# Altium project filter_bank.PrjPcb
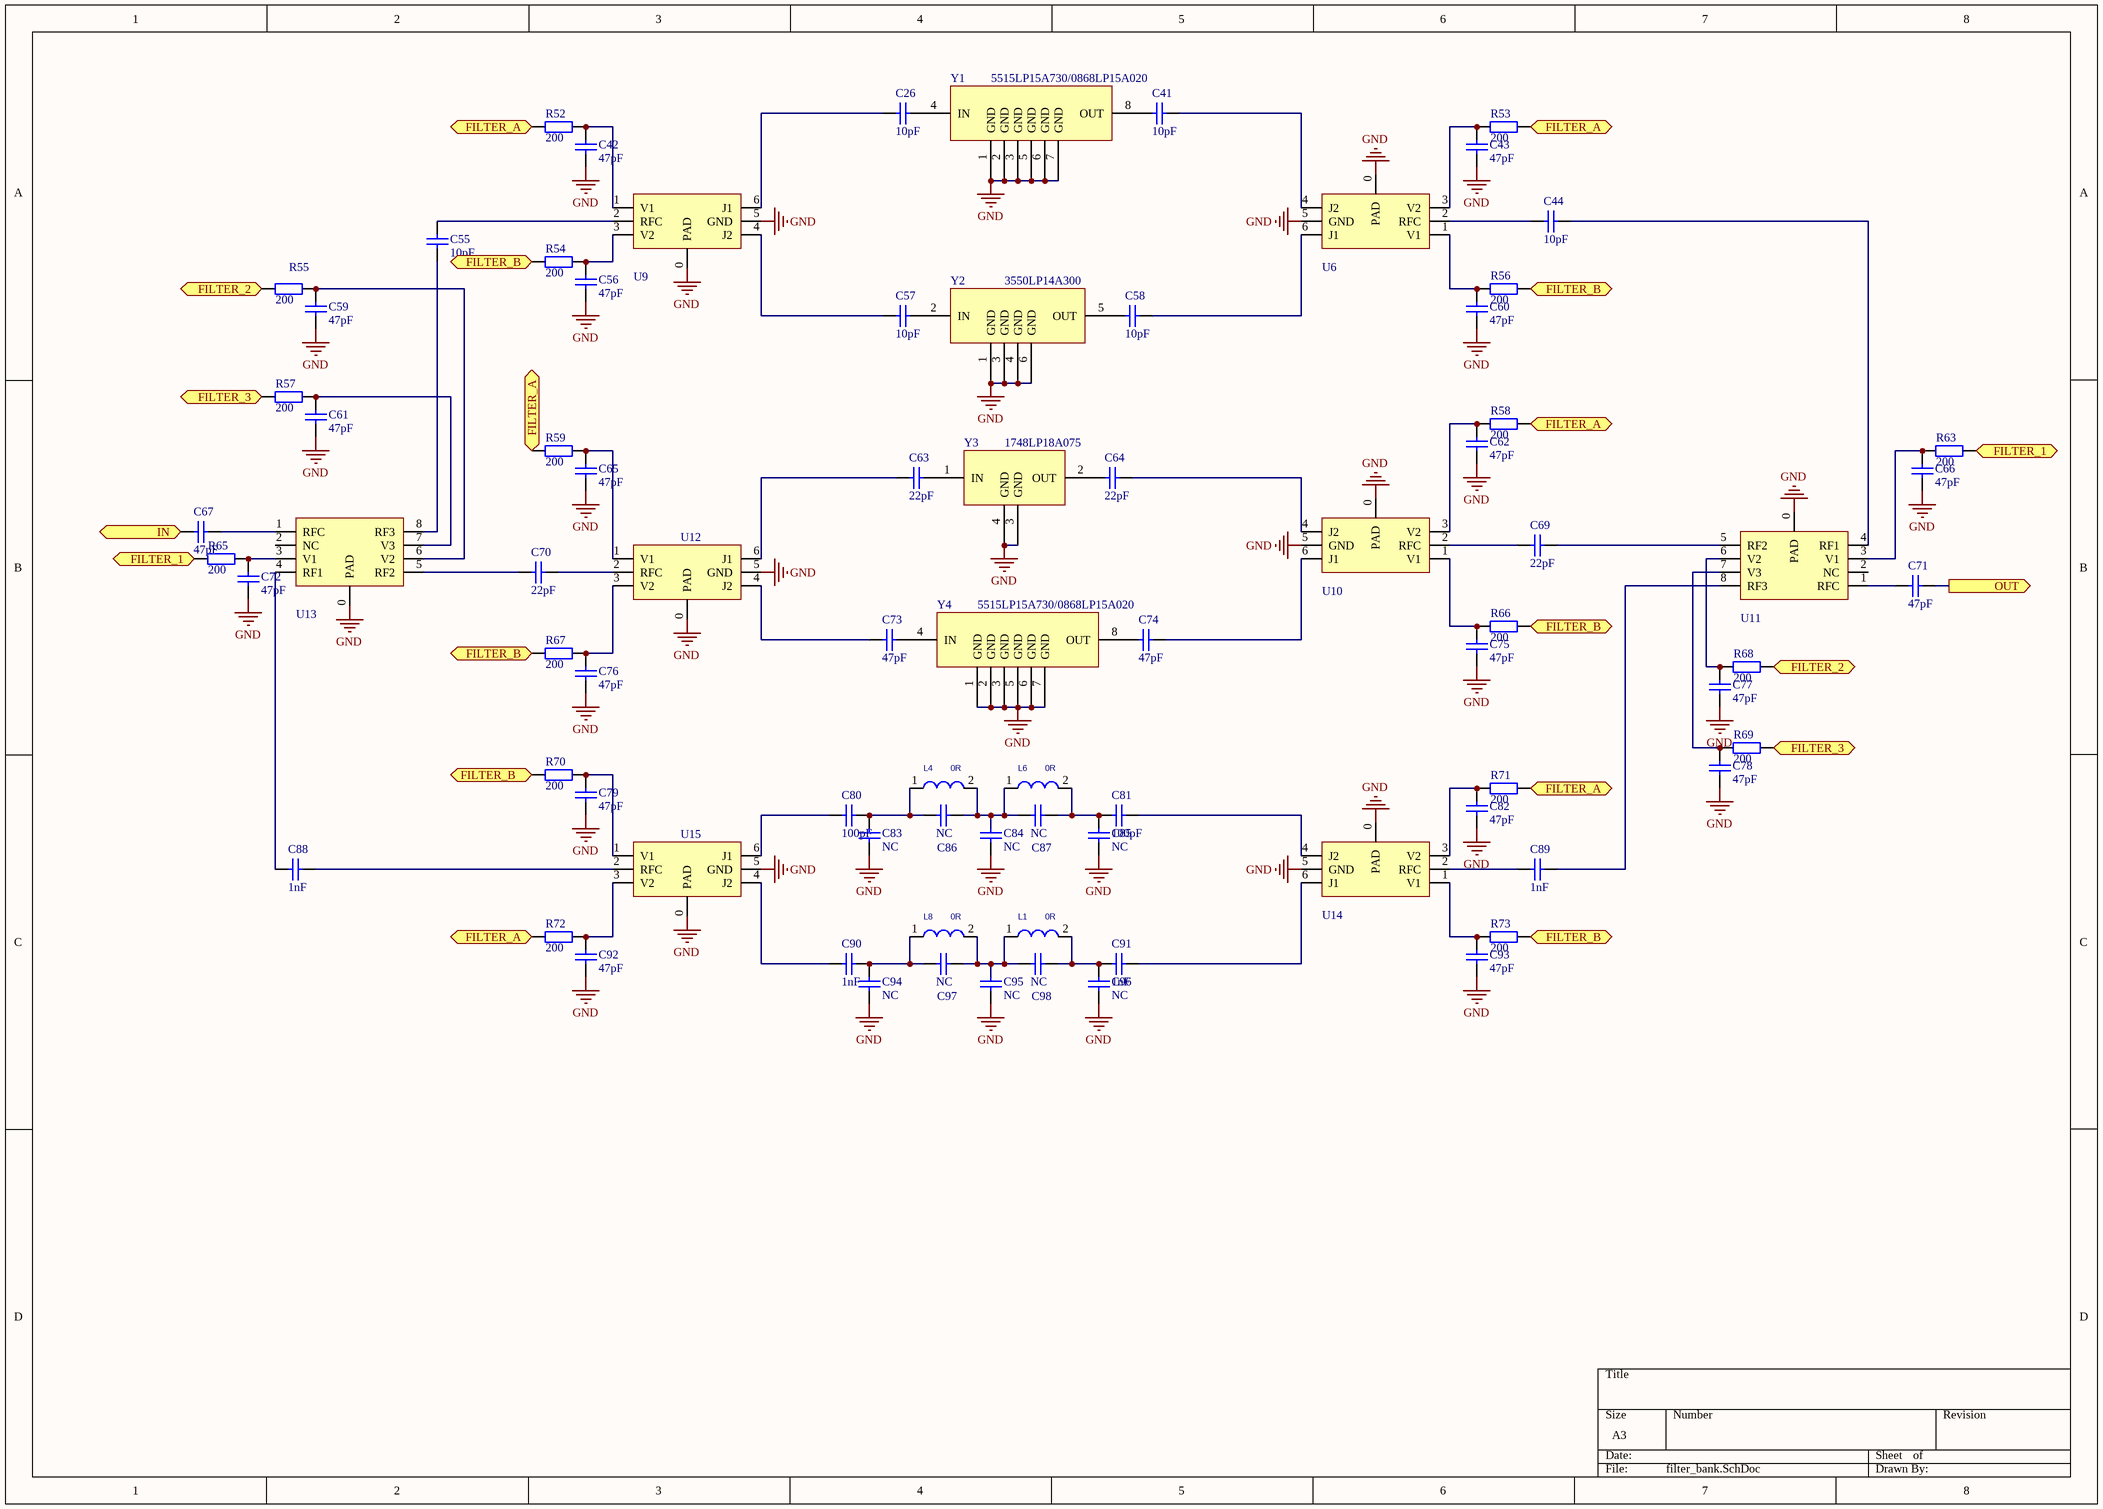
[diagram p0: filter_bank.SchDoc]
2 sheets, 91 parts. Net scope: flat (ports and power ports of the same name join across sheets).
Board file: filter_bank.PcbDoc
Sheets:
  filter_bank.SchDoc
  power.SchDoc

## Sheet filter_bank.SchDoc
size A3

### Parts
C26  10pF  [0402]
C41  10pF  [0402]
C42  47pF  [0402]
C43  47pF  [0402]
C44  10pF  [0402]
C55  10pF  [0402]
C56  47pF  [0402]
C57  10pF  [0402]
C58  10pF  [0402]
C59  47pF  [0402]
C60  47pF  [0402]
C61  47pF  [0402]
C62  47pF  [0402]
C63  22pF  [0402]
C64  22pF  [0402]
C65  47pF  [0402]
C66  47pF  [0402]
C67  47pF  [0402]
C69  22pF  [0402]
C70  22pF  [0402]
C71  47pF  [0402]
C72  47pF  [0402]
C73  47pF  [0402]
C74  47pF  [0402]
C75  47pF  [0402]
C76  47pF  [0402]
C77  47pF  [0402]
C78  47pF  [0402]
C79  47pF  [0402]
C80  100pF  [0402]
C81  100pF  [0402]
C82  47pF  [0402]
C83  NC  [0402]
C84  NC  [0402]
C85  NC  [0402]
C86  NC  [0402]
C87  NC  [0402]
C88  1nF  [0402]
C89  1nF  [0402]
C90  1nF  [0402]
C91  1nF  [0402]
C92  47pF  [0402]
C93  47pF  [0402]
C94  NC  [0402]
C95  NC  [0402]
C96  NC  [0402]
C97  NC  [0402]
C98  NC  [0402]
L1  0R  [0402]
L4  0R  [0402]
L6  0R  [0402]
L8  0R  [0402]
R52  200  [0402]
R53  200  [0402]
R54  200  [0402]
R55  200  [0402]
R56  200  [0402]
R57  200  [0402]
R58  200  [0402]
R59  200  [0402]
R63  200  [0402]
R65  200  [0402]
R66  200  [0402]
R67  200  [0402]
R68  200  [0402]
R69  200  [0402]
R70  200  [0402]
R71  200  [0402]
R72  200  [0402]
R73  200  [0402]
U6  SKY13320  [SKY65404-31]  (value not drawn)
U9  SKY13320  [SKY65404-31]  (value not drawn)
U10  SKY13320  [SKY65404-31]  (value not drawn)
U11  SKY13417  [SKY13317]  (value not drawn)
U12  SKY13320  [SKY65404-31]  (value not drawn)
U13  SKY13417  [SKY13317]  (value not drawn)
U14  SKY13320  [SKY65404-31]  (value not drawn)
U15  SKY13320  [SKY65404-31]  (value not drawn)
Y1  5515LP15A730/0868LP15A020  [5515LP15A730/0868LP15A020]
Y2  3550LP14A300  [3550LP14A300]
Y3  1748LP18A075  [1748LP18A075]
Y4  5515LP15A730/0868LP15A020  [5515LP15A730/0868LP15A020]

### Ports
FILTER_1, FILTER_2, FILTER_3, FILTER_A, FILTER_B, IN (in), OUT (out)

### Nets
GND: C42.1 C43.1 C56.1 C59.1 C60.1 C61.1 C62.1 C65.1 C66.1 C72.1 C75.1 C76.1 C77.1 C78.1 C79.1 C82.1 C83.1 C84.1 C85.1 C92.1 C93.1 C94.1 C95.1 C96.1 U6.0(PAD) U6.5(GND) U9.0(PAD) U9.5(GND) U10.0(PAD) U10.5(GND) U11.0(PAD) U12.0(PAD) U12.5(GND) U13.0(PAD) U14.0(PAD) U14.5(GND) U15.0(PAD) U15.5(GND) Y1.1(GND) Y1.2(GND) Y1.3(GND) Y1.5(GND) Y1.6(GND) Y1.7(GND) Y2.1(GND) Y2.3(GND) Y2.4(GND) Y2.6(GND) Y3.3(GND) Y3.4(GND) Y4.1(GND) Y4.2(GND) Y4.3(GND) Y4.5(GND) Y4.6(GND) Y4.7(GND)
NetAnt1_1: C67.2 ; port IN
NetAnt2_1: C71.1 ; port OUT
NetC26_1: C26.1 Y1.4(IN)
NetC26_2: C26.2 U9.6(J1)
NetC41_1: C41.1 U6.4(J2)
NetC41_2: C41.2 Y1.8(OUT)
NetC42_2: C42.2 R52.2 U9.1(V1)
NetC43_2: C43.2 R53.1 U6.3(V2)
NetC44_1: C44.1 U11.4(RF1)
NetC44_2: C44.2 U6.2(RFC)
NetC55_1: C55.1 U9.2(RFC)
NetC55_2: C55.2 U13.8(RF3)
NetC56_2: C56.2 R54.2 U9.3(V2)
NetC57_1: C57.1 Y2.2(IN)
NetC57_2: C57.2 U9.4(J2)
NetC58_1: C58.1 U6.6(J1)
NetC58_2: C58.2 Y2.5(OUT)
NetC59_2: C59.2 R55.1 U13.6(V2)
NetC60_2: C60.2 R56.1 U6.1(V1)
NetC61_2: C61.2 R57.2 U13.7(V3)
NetC62_2: C62.2 R58.1 U10.3(V2)
NetC63_1: C63.1 Y3.1(IN)
NetC63_2: C63.2 U12.6(J1)
NetC64_1: C64.1 Y3.2(OUT)
NetC64_2: C64.2 U10.4(J2)
NetC65_2: C65.2 R59.1 U12.1(V1)
NetC66_2: C66.2 R63.1 U11.3(V1)
NetC67_1: C67.1 U13.1(RFC)
NetC69_1: C69.1 U11.5(RF2)
NetC69_2: C69.2 U10.2(RFC)
NetC70_1: C70.1 U12.2(RFC)
NetC70_2: C70.2 U13.5(RF2)
NetC71_2: C71.2 U11.1(RFC)
NetC72_2: C72.2 R65.2 U13.3(V1)
NetC73_1: C73.1 Y4.4(IN)
NetC73_2: C73.2 U12.4(J2)
NetC74_1: C74.1 U10.6(J1)
NetC74_2: C74.2 Y4.8(OUT)
NetC75_2: C75.2 R66.1 U10.1(V1)
NetC76_2: C76.2 R67.2 U12.3(V2)
NetC77_2: C77.2 R68.1 U11.6(V2)
NetC78_2: C78.2 R69.1 U11.7(V3)
NetC79_2: C79.2 R70.2 U15.1(V1)
NetC80_1: C80.1 C83.2 C86.2 L4.1
NetC80_2: C80.2 U15.6(J1)
NetC81_1: C81.1 U14.4(J2)
NetC81_2: C81.2 C85.2 C87.1 L6.2
NetC82_2: C82.2 R71.1 U14.3(V2)
NetC84_2: C84.2 C86.1 C87.2 L4.2 L6.1
NetC88_1: C88.1 U15.2(RFC)
NetC88_2: C88.2 U13.4(RF1)
NetC89_1: C89.1 U11.8(RF3)
NetC89_2: C89.2 U14.2(RFC)
NetC90_1: C90.1 C94.2 C97.2 L8.1
NetC90_2: C90.2 U15.4(J2)
NetC91_1: C91.1 U14.6(J1)
NetC91_2: C91.2 C96.2 C98.1 L1.2
NetC92_2: C92.2 R72.2 U15.3(V2)
NetC93_2: C93.2 R73.1 U14.1(V1)
NetC95_2: C95.2 C97.1 C98.2 L1.1 L8.2
NetR52_1: R52.1 R53.2 R58.2 R59.2 R71.2 R72.1 ; port FILTER_A
NetR54_1: R54.1 R56.2 R66.2 R67.1 R70.1 R73.2 ; port FILTER_B
NetR55_2: R55.2 R68.2 ; port FILTER_2
NetR57_1: R57.1 R69.2 ; port FILTER_3
NetR63_2: R63.2 R65.1 ; port FILTER_1

Not connected (* = marked no-connect by the designer): U11 2(NC); U13 2(NC)

### Library data of the parts
C26 C41-C44 C55-C67 C69-C98 = Cap: Capacitor; Published: 8-Jun-2000; LatestRevisionDate: 17-Jul-2002; LatestRevisionNote: Re-released for DXP Platform.; PackageReference: RAD-0.3; Publisher: Altium Limited; PackageDescription: Radial Cap, Thru-Hole; 2 Leads; 0.3 in Pin Spacing
L1 L4 L6 L8 = L/2.5*2.0
R52-R59 R63 R65-R73 = Res2: Resistor; Published: 8-Jun-2000; LatestRevisionDate: 17-Jul-2002; LatestRevisionNote: Re-released for DXP Platform.; PackageReference: AXIAL-0.4; Publisher: Altium Limited; PackageDescription: Axial Device, Thru-Hole; 2 Leads; 0.4 in Pin Spacing

## Sheet power.SchDoc
size A4
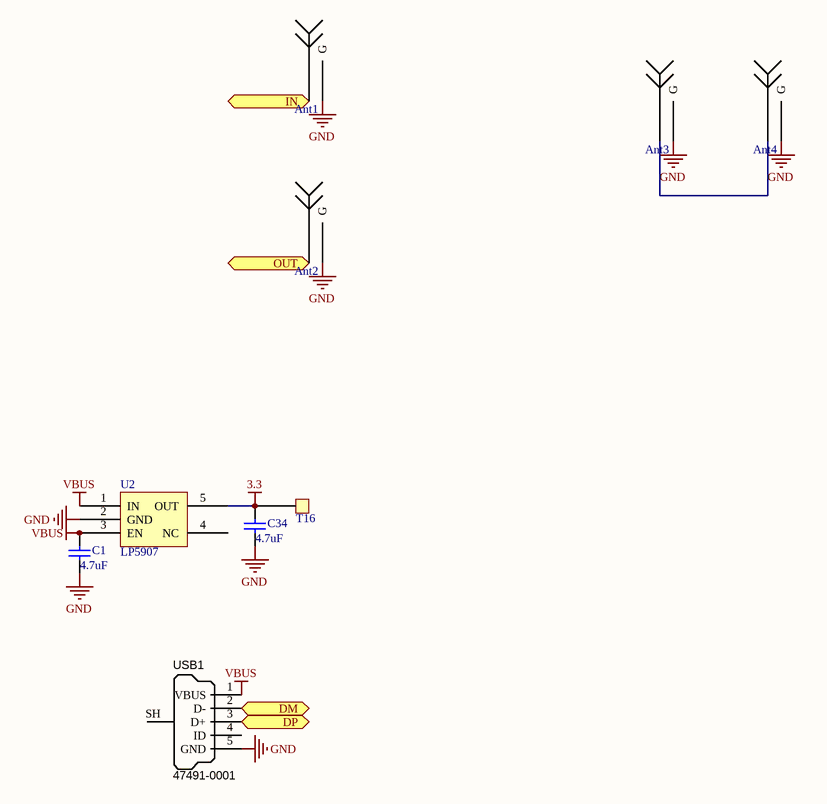
[diagram p1: power.SchDoc]

### Parts
Ant1  Antenna  [SMA-2]  (value not drawn)
Ant2  Antenna  [SMA-2]  (value not drawn)
Ant3  Antenna  [SMA-2]  (value not drawn)
Ant4  Antenna  [SMA-2]  (value not drawn)
C1  4.7uF  [0603]
C34  4.7uF  [0603]
T16  TestPad  [TestPad - 1mm]  (value not drawn)
U2  LP5907  [SOT23-5]
USB1  Manufacturer Part Number 1: 47491-0001  [MICRO-YZX]  (hidden comment: USB Micro Type B)

### Ports
DM, DP, IN (in), OUT (out)

### Nets
3.3: C34.2 T16.1 U2.5(OUT)
GND: Ant1.GND(G) Ant2.GND(G) Ant3.GND(G) Ant4.GND(G) C1.1 C34.1 U2.2(GND) USB1.5(GND)
VBUS: C1.2 U2.1(IN) U2.3(EN) USB1.1(VBUS)
NetAnt1_1: Ant1.1 ; port IN
NetAnt2_1: Ant2.1 ; port OUT
NetAnt3_1: Ant3.1 Ant4.1
NetUSB1_2: USB1.2(D-) ; port DM
NetUSB1_3: USB1.3(D+) ; port DP

Not connected (* = marked no-connect by the designer): U2 4(NC); USB1 4(ID) SH(Shell)

### Library data of the parts
C1 C34 = Cap: Capacitor; Published: 8-Jun-2000; LatestRevisionDate: 17-Jul-2002; LatestRevisionNote: Re-released for DXP Platform.; PackageReference: RAD-0.3; Publisher: Altium Limited; PackageDescription: Radial Cap, Thru-Hole; 2 Leads; 0.3 in Pin Spacing
USB1 = USB_Micro_TypeB: Connector SMD USB Micro Type B middle mount; Manufacturer 1: Molex Inc; SCDType: undef; Package / Case: SMD; Supplier 1: Digi-Key; Supplier Part Number 1: WM17142CT-ND

## Nets that join several sheets
GND: filter_bank (56 pins), power (8 pins)
NetAnt1_1: filter_bank (C67.2), power (Ant1.1)
NetAnt2_1: filter_bank (C71.1), power (Ant2.1)